# Altium schematic sheet iSystem-ST_MOD.SchDoc
size A4; SheetNumber: 5; SheetTotal: 8
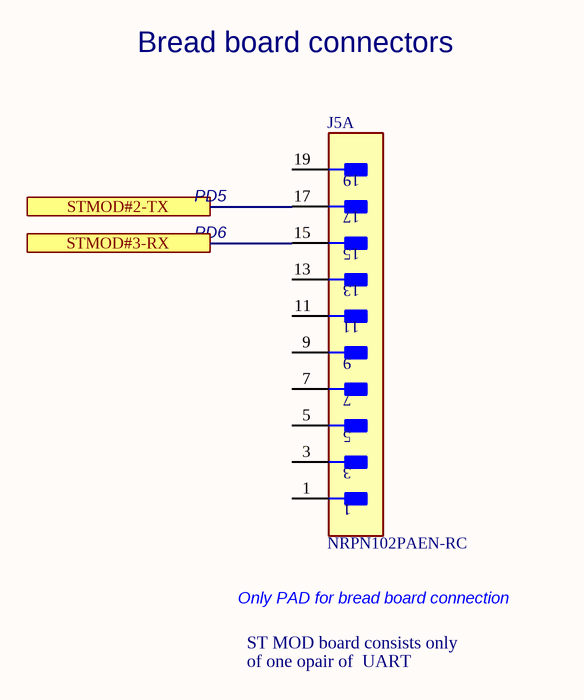
[diagram p0: iSystem-ST_MOD.SchDoc]

## Parts
J5  NRPN102PAEN-RC  [FP-NRPN102PAEN-RC-MFG]  (part A of 2)

## Ports
STMOD#2-TX, STMOD#3-RX

## Nets
STMOD#2-TX: J5.17 ; port STMOD#2-TX
STMOD#3-RX: J5.15 ; port STMOD#3-RX

Not connected (* = marked no-connect by the designer): J5 1 3 5 7 9 11 13 19

## Notes on the sheet
- Bread board connectors
- PD5
- PD6
- Only PAD for bread board connection
- ST MOD board consists only
- of one opair of  UART

## Library data of the parts
J5 = CMP-25680-000023-1: CONN HEADER VERT 20POS 2MM; Manufacturer: Sullins; Current Rating: 2A; Voltage Rating: 150V; Number Of Contacts: 20; Conn Gender: Male; Conn Orientation: Straight; RoHS: TRUE; Temperature: -40°C to +105°C; Pitch: 2mm; Footprint Url: https://drawings-pdf.s3.amazonaws.com/10637.pdf; Lead Free: Yes; Height: 5.95mm; Package: 0; ComponentLink2URL: https://s3.amazonaws.com/catalogspreads-pdf/PAGE104-105%202mm%20MALE%20HDR%20ST%20RA%20SMT.pdf; Device Class L1: Connectors; Digikey Description: CONN HEADER VERT 20POS 2MM; Device Class L2: Headers and Wire Housings; Temperature Range High: +105°C; Temperature Range Low: -40°C; Number Of Rows: 2; Category: Conn; Automotive: No; Device Class L3: unset; ComponentLink2Description: Datasheet; Manufacturer Part Number: NRPN102PAEN-RC; Contact Material: Gold; Octopart: https://octopart.com/nrpn102paen-rc-sullins-12086181